# Altium schematic sheet IC_VCE.SchDoc
size A4
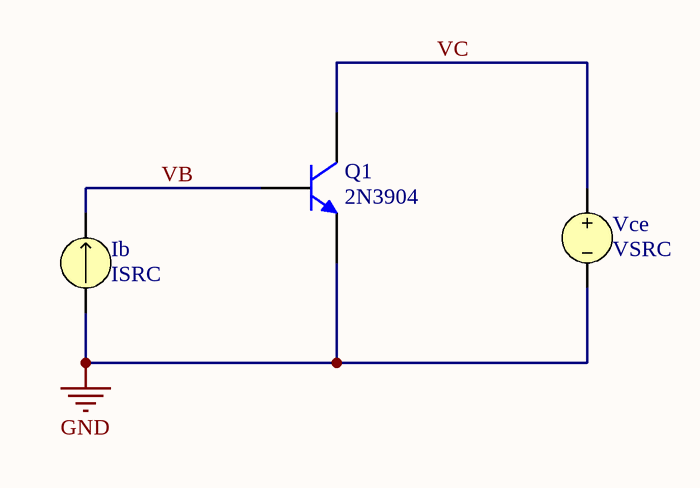
[diagram p0: IC_VCE.SchDoc]

## Parts
Ib  ISRC
Q1  2N3904  [TO-92A]
Vce  VSRC

## Nets
GND: Ib.1 Q1.1(E) Vce.2
VB: Ib.2 Q1.2(B)
VC: Q1.3(C) Vce.1

## Library data of the parts
Ib = ISRC: Current Source; Note: PCB Footprint - Not required; Value: 1mA; Published: 8-Jun-2000; LatestRevisionDate: 17-Jul-2002; LatestRevisionNote: Re-released for DXP Platform.; PackageReference: Not Applicable; Publisher: Altium Limited
Q1 = 2N3904: NPN General Purpose Amplifier; Published: 8-Jun-2000; LatestRevisionDate: 15-Jan-2003; LatestRevisionNote: PCB Footprint 'BCY-W3/D4.7' replaced; DatasheetDocument: 1997; PackageDocument: Sep-1998; PackageReference: TO-92A; Publisher: Altium Limited; Code_JEDEC: TO-92A; ComponentLink1Description: Manufacturer Link; ComponentLink1URL: http://www.fairchildsemi.com/; ComponentLink2Description: Datasheet; ComponentLink2URL: http://www.fairchildsemi.com/ds/2N%2F2N3904.pdf
Vce = VSRC: Voltage Source; Note: PCB Footprint - Not required; Value: 1; Published: 8-Jun-2000; LatestRevisionDate: 17-Jul-2002; LatestRevisionNote: Re-released for DXP Platform.; PackageReference: Not Applicable; Publisher: Altium Limited